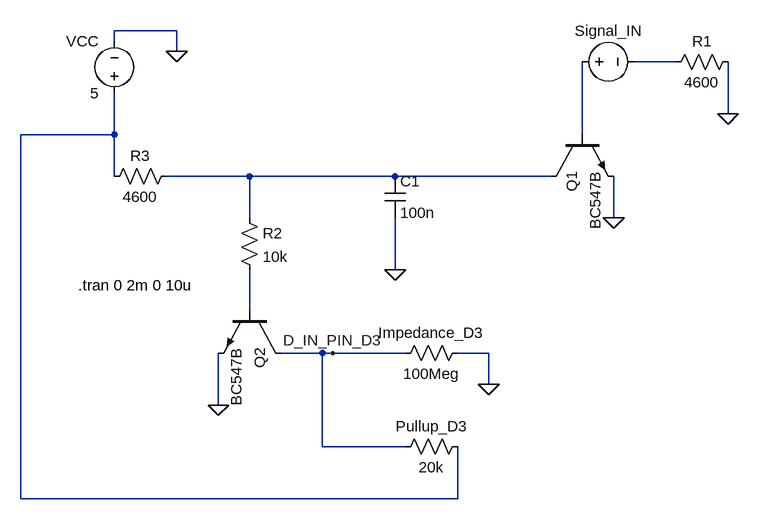
[diagram p0: schematic DataIn.asc]
DataIn.asc, the LTspice schematic file:
Version 4
SHEET 1 880 788
WIRE -240 64 -336 64
WIRE -336 80 -336 64
WIRE -240 96 -240 64
WIRE 528 112 464 112
WIRE 608 192 608 112
WIRE -336 224 -336 160
WIRE -336 224 -480 224
WIRE 384 224 384 112
WIRE -336 288 -336 224
WIRE -128 288 -256 288
WIRE 96 288 -128 288
WIRE 336 288 96 288
WIRE -128 352 -128 288
WIRE 432 352 432 288
WIRE 96 432 96 352
WIRE -128 496 -128 432
WIRE -16 560 -80 560
WIRE 0 560 -16 560
WIRE 112 560 0 560
WIRE 240 560 192 560
WIRE 240 608 240 560
WIRE -176 640 -176 560
WIRE -16 704 -16 560
WIRE 112 704 -16 704
WIRE -480 784 -480 224
WIRE 192 784 192 704
WIRE 192 784 -480 784
FLAG 608 192 0
FLAG 432 352 0
FLAG -240 96 0
FLAG 96 432 0
FLAG -176 640 0
FLAG 240 608 0
FLAG 0 560 D_IN_PIN_D3
SYMBOL voltage 368 112 R270
WINDOW 0 32 56 VTop 2
WINDOW 3 -32 56 Invisible 2
WINDOW 123 0 0 Left 0
WINDOW 39 0 0 Left 0
SYMATTR InstName Signal_IN
SYMATTR Value PWL(0 5 400u 5 401u 0 800u 0 801u 5 1000u 5 1001u 0 1040u 0 1041u 5 1200u 5 1201u 0 1600u 0 1601u 5 1800u 5 1801u 0 2000u 0)
SYMBOL res 624 96 R90
WINDOW 0 0 56 VBottom 2
WINDOW 3 32 56 VTop 2
SYMATTR InstName R1
SYMATTR Value 4600
SYMBOL npn 336 224 M90
SYMATTR InstName Q1
SYMATTR Value BC547B
SYMBOL res -240 272 R90
WINDOW 0 0 56 VBottom 2
WINDOW 3 32 56 VTop 2
SYMATTR InstName R3
SYMATTR Value 4600
SYMBOL voltage -336 176 R180
WINDOW 0 24 96 Left 2
WINDOW 3 24 16 Left 2
WINDOW 123 0 0 Left 0
WINDOW 39 0 0 Left 0
SYMATTR InstName VCC
SYMATTR Value 5
SYMBOL cap 80 288 R0
SYMATTR InstName C1
SYMATTR Value 100n
SYMBOL npn -80 496 R90
SYMATTR InstName Q2
SYMATTR Value BC547B
SYMBOL res -144 336 R0
SYMATTR InstName R2
SYMATTR Value 10k
SYMBOL res 208 544 R90
WINDOW 0 0 56 VBottom 2
WINDOW 3 32 56 VTop 2
SYMATTR InstName Impedance_D3
SYMATTR Value 100Meg
SYMBOL res 208 688 R90
WINDOW 0 0 56 VBottom 2
WINDOW 3 32 56 VTop 2
SYMATTR InstName Pullup_D3
SYMATTR Value 20k
TEXT -392 456 Left 2 !.tran 0 2m 0 10u

The netlist it stands for:
* DataIn.asc
V§Signal_IN N003 N001 PWL(0 5 400u 5 401u 0 800u 0 801u 5 1000u 5 1001u 0 1040u 0 1041u 5 1200u 5 1201u 0 1600u 0 1601u 5 1800u 5 1801u 0 2000u 0)
R1 0 N001 4600
Q1 N004 N003 0 0 BC547B
R3 N004 N002 4600
VCC N002 0 5
C1 N004 0 100n
Q2 D_IN_PIN_D3 N005 0 0 BC547B
R2 N004 N005 10k
R§Impedance_D3 0 D_IN_PIN_D3 100Meg
R§Pullup_D3 N002 D_IN_PIN_D3 20k
.model NPN NPN
.model PNP PNP
.lib standard.bjt
.tran 0 2m 0 10u
.backanno
.end